# Altium project SRC Pneumatic Controller.PrjPcb
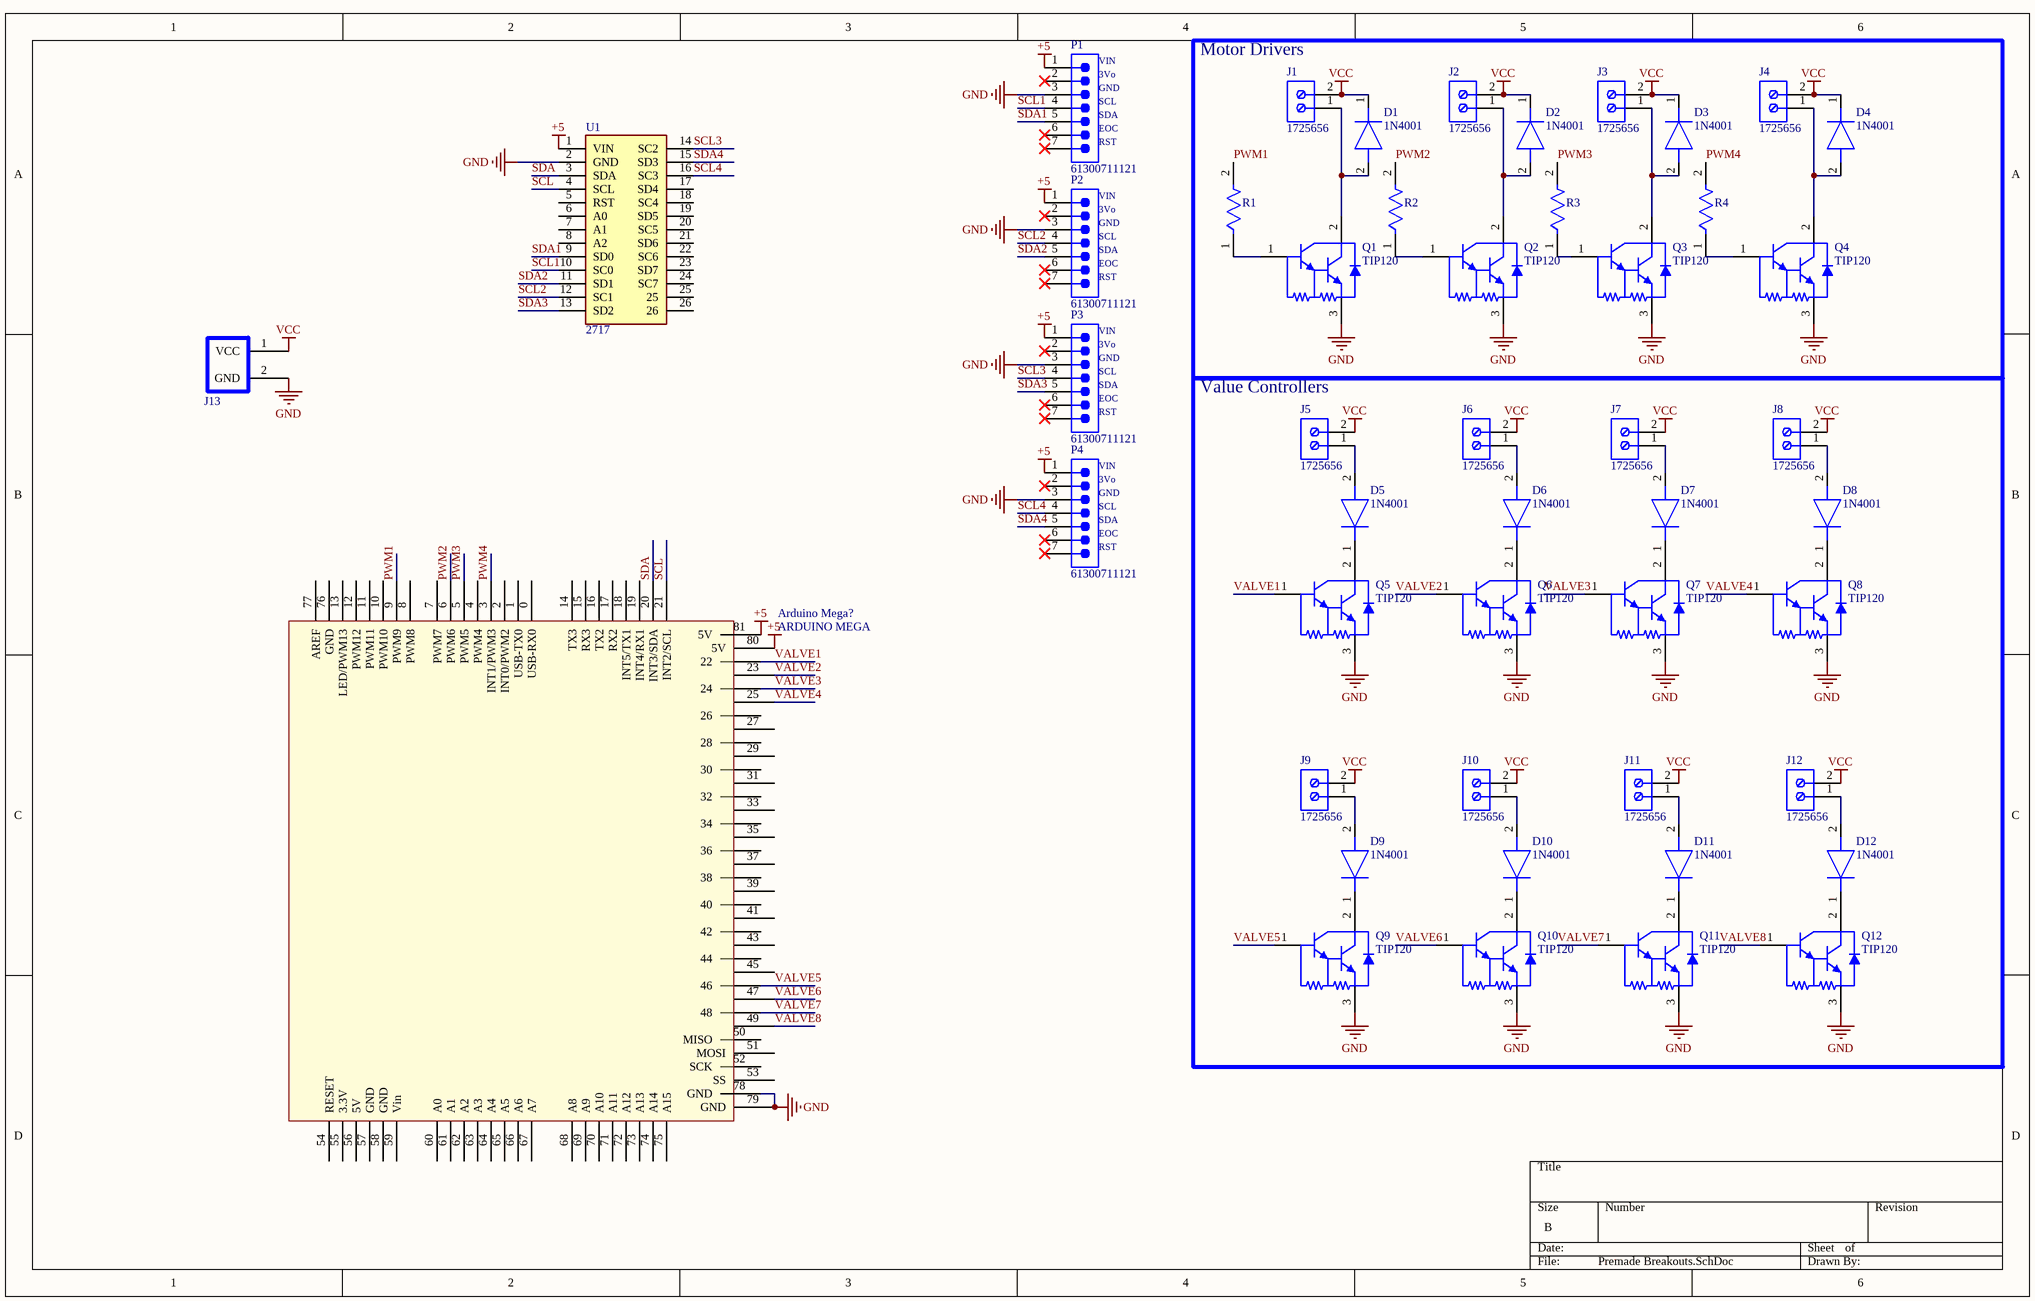
[diagram p0: Premade Breakouts.SchDoc]
1 sheet, 47 parts. Net scope: global (net labels, ports and power ports of the same name join across sheets).
Board file: MegaHatPnuematic.PcbDoc

## Sheet Premade Breakouts.SchDoc
size B; SheetNumber: 1; SheetTotal: 1

### Parts
Arduino_Mega?  ARDUINO MEGA  [Arduino Mega]
D1  1N4001  [DIOAD1530W84L490D260]
D2  1N4001  [DIOAD1530W84L490D260]
D3  1N4001  [DIOAD1530W84L490D260]
D4  1N4001  [DIOAD1530W84L490D260]
D5  1N4001  [DIOAD1530W84L490D260]
D6  1N4001  [DIOAD1530W84L490D260]
D7  1N4001  [DIOAD1530W84L490D260]
D8  1N4001  [DIOAD1530W84L490D260]
D9  1N4001  [DIOAD1530W84L490D260]
D10  1N4001  [DIOAD1530W84L490D260]
D11  1N4001  [DIOAD1530W84L490D260]
D12  1N4001  [DIOAD1530W84L490D260]
J1  1725656  [PHOE-1725656-2]
J2  1725656  [PHOE-1725656-2]
J3  1725656  [PHOE-1725656-2]
J4  1725656  [PHOE-1725656-2]
J5  1725656  [PHOE-1725656-2]
J6  1725656  [PHOE-1725656-2]
J7  1725656  [PHOE-1725656-2]
J8  1725656  [PHOE-1725656-2]
J9  1725656  [PHOE-1725656-2]
J10  1725656  [PHOE-1725656-2]
J11  1725656  [PHOE-1725656-2]
J12  1725656  [PHOE-1725656-2]
J13  Power  [PowerConnector]  (value not drawn)
P1  61300711121  [61300711121]
P2  61300711121  [61300711121]
P3  61300711121  [61300711121]
P4  61300711121  [61300711121]
Q1  TIP120  [ONSC-TO-220-3-221A-09]
Q2  TIP120  [ONSC-TO-220-3-221A-09]
Q3  TIP120  [ONSC-TO-220-3-221A-09]
Q4  TIP120  [ONSC-TO-220-3-221A-09]
Q5  TIP120  [ONSC-TO-220-3-221A-09]
Q6  TIP120  [ONSC-TO-220-3-221A-09]
Q7  TIP120  [ONSC-TO-220-3-221A-09]
Q8  TIP120  [ONSC-TO-220-3-221A-09]
Q9  TIP120  [ONSC-TO-220-3-221A-09]
Q10  TIP120  [ONSC-TO-220-3-221A-09]
Q11  TIP120  [ONSC-TO-220-3-221A-09]
Q12  TIP120  [ONSC-TO-220-3-221A-09]
R1  MRS25000C1000FRP00  [FP-MRS25-MFG]  (value not drawn)
R2  MRS25000C1000FRP00  [FP-MRS25-MFG]  (value not drawn)
R3  MRS25000C1000FRP00  [FP-MRS25-MFG]  (value not drawn)
R4  MRS25000C1000FRP00  [FP-MRS25-MFG]  (value not drawn)
U1  2717  [2717]

### Blocks framed on the sheet
Motor Drivers: D1-D4 J1-J4 Q1-Q4 R1-R4
Value Controllers: D5-D12 J5-J12 Q5-Q12

### Nets
+5: Arduino_Mega?.80(5V) Arduino_Mega?.81(5V) P1.1 P2.1 P3.1 P4.1 U1.1(VIN)
GND: Arduino_Mega?.78(GND) Arduino_Mega?.79(GND) J13.2(GND) P1.3 P2.3 P3.3 P4.3 Q1.3(E) Q2.3(E) Q3.3(E) Q4.3(E) Q5.3(E) Q6.3(E) Q7.3(E) Q8.3(E) Q9.3(E) Q10.3(E) Q11.3(E) Q12.3(E) U1.2(GND)
VCC: D1.1(K) D2.1(K) D3.1(K) D4.1(K) J1.2 J2.2 J3.2 J4.2 J5.2 J6.2 J7.2 J8.2 J9.2 J10.2 J11.2 J12.2 J13.1(VCC)
PWM1: Arduino_Mega?.9(PWM9) R1.2
PWM2: Arduino_Mega?.6(PWM6) R2.2
PWM3: Arduino_Mega?.5(PWM5) R3.2
PWM4: Arduino_Mega?.3(INT1/PWM3) R4.2
SCL: Arduino_Mega?.21(INT2/SCL) U1.4(SCL)
SCL1: P1.4 U1.10(SC0)
SCL2: P2.4 U1.12(SC1)
SCL3: P3.4 U1.14(SC2)
SCL4: P4.4 U1.16(SC3)
SDA: Arduino_Mega?.20(INT3/SDA) U1.3(SDA)
SDA1: P1.5 U1.9(SD0)
SDA2: P2.5 U1.11(SD1)
SDA3: P3.5 U1.13(SD2)
SDA4: P4.5 U1.15(SD3)
VALVE1: Arduino_Mega?.22 Q5.1(B)
VALVE2: Arduino_Mega?.23 Q6.1(B)
VALVE3: Arduino_Mega?.24 Q7.1(B)
VALVE4: Arduino_Mega?.25 Q8.1(B)
VALVE5: Arduino_Mega?.46 Q9.1(B)
VALVE6: Arduino_Mega?.47 Q10.1(B)
VALVE7: Arduino_Mega?.48 Q11.1(B)
VALVE8: Arduino_Mega?.49 Q12.1(B)
NetD1_2: D1.2(A) J1.1 Q1.2(C)
NetD2_2: D2.2(A) J2.1 Q2.2(C)
NetD3_2: D3.2(A) J3.1 Q3.2(C)
NetD4_2: D4.2(A) J4.1 Q4.2(C)
NetD5_1: D5.1(K) Q5.2(C)
NetD5_2: D5.2(A) J5.1
NetD6_1: D6.1(K) Q6.2(C)
NetD6_2: D6.2(A) J6.1
NetD7_1: D7.1(K) Q7.2(C)
NetD7_2: D7.2(A) J7.1
NetD8_1: D8.1(K) Q8.2(C)
NetD8_2: D8.2(A) J8.1
NetD9_1: D9.1(K) Q9.2(C)
NetD9_2: D9.2(A) J9.1
NetD10_1: D10.1(K) Q10.2(C)
NetD10_2: D10.2(A) J10.1
NetD11_1: D11.1(K) Q11.2(C)
NetD11_2: D11.2(A) J11.1
NetD12_1: D12.1(K) Q12.2(C)
NetD12_2: D12.2(A) J12.1
NetQ1_1: Q1.1(B) R1.1
NetQ2_1: Q2.1(B) R2.1
NetQ3_1: Q3.1(B) R3.1
NetQ4_1: Q4.1(B) R4.1

Not connected (* = marked no-connect by the designer): Arduino_Mega? 0(USB-RX0) 1(USB-TX0) 2(INT0/PWM2) 4(PWM4) 7(PWM7) 8(PWM8) 10(PWM10) 11(PWM11) 12(PWM12) 13(LED/PWM13) 14(TX3) 15(RX3) 16(TX2) 17(RX2) 18(INT5/TX1) 19(INT4/RX1) 26 27 28 29 30 31 32 33 34 35 36 37 38 39 40 41 42 43 44 45 50(MISO) 51(MOSI) 52(SCK) 53(SS) 54(RESET) 55(3.3V) 56(5V) 57(GND) 58(GND) 59(Vin) 60(A0) 61(A1) 62(A2) 63(A3) 64(A4) 65(A5) 66(A6) 67(A7) 68(A8) 69(A9) 70(A10) 71(A11) 72(A12) 73(A13) 74(A14) 75(A15) 76(GND) 77(AREF); P1 2* 6* 7*; P2 2* 6* 7*; P3 2* 6* 7*; P4 2* 6* 7*; U1 5(RST) 6(A0) 7(A1) 8(A2) 17(SD4) 18(SC4) 19(SD5) 20(SC5) 21(SD6) 22(SC6) 23(SD7) 24(SC7) 25 26

### Notes on the sheet
- (near P1) VIN
- (near P1) 3Vo
- (near P1) GND
- (near P1) SCL
- (near P1) SDA
- (near P1) EOC
- (near P1) RST
- (near P2) VIN
- (near P2) 3Vo
- (near P2) GND
- (near P2) SCL
- (near P2) SDA
- (near P2) EOC
- (near P2) RST
- (near P3) VIN
- (near P3) 3Vo
- (near P3) GND
- (near P3) SCL
- (near P3) SDA
- (near P3) EOC
- (near P3) RST
- (near P4) VIN
- (near P4) 3Vo
- (near P4) GND
- (near P4) SCL
- (near P4) SDA
- (near P4) EOC
- (near P4) RST

### Library data of the parts
D1-D12 = 1N4001: Diode; Manufacturer_Name: Diotec; Datasheet Link: https://www.arrow.com/en/products/1n4001/diotec-semiconductor-ag; Manufacturer_Part_Number: 1N4001; Mouser Part Number: 637-1N4001; Mouser Price/Stock: https://www.mouser.co.uk/ProductDetail/Diotec-Semiconductor/1N4001?qs=OlC7AqGiEDlll8NA510wmA%3D%3D; Arrow Part Number: 1N4001; Arrow Price/Stock: https://www.arrow.com/en/products/1n4001/diotec-semiconductor-ag?region=europe
J1-J12 = CMP-2000-05299-1: Male Header, Pitch 2.54 mm, 1 x 2 Position, Height 9 mm, Tail Length 3.5 mm; Manufacturer: Phoenix Contact; Number of contacts: 2; Content: 250pc(s); Pitch: 2.54mm; Industrial packaging: Yes; Colour: Green; Manufacturer part No.: 1725656; Type: MPT0,5/2-2,54; Datasheet URL: http://datasheet.octopart.com/1725656-Phoenix-Contact-datasheet-5302866.pdf; Manufacturer URL: http://www.phoenixcontact.com/; Datasheet Version: Apr-08
P1-P4 = CMP-1502-01074-3: NexarPartId: 32855531; Current Rating: 3A; Number of Positions: 7; Connector Type: Male Pin; Gender: Male; Operating Supply Voltage: 250V; Pitch: 2.54mm; Contact Resistance: 20mΩ; Contact Material: Copper; Contact Plating: Gold; Contact Mating Length: 5.9944mm; Mount: Through Hole; Termination: Solder; Number of Pins: 7; Color: Black; Packaging: Bulk; REACH SVHC: Unknown; Orientation: Vertical; Lead Pitch: 2.54mm; RoHS: Compliant; Number of Rows: 1; Number of Contacts: 7
Q1-Q12 = CMP-1047-00140-1: Plastic Medium-Power, Complementary Silicon Transistor, 3-Pin TO-220, Tube; Manufacturer: On Semiconductor; IC Continuous (A): 5; Polarity: NPN; ComponentLink2URL: http://www.onsemi.cn/pub_link/Collateral/TIP120-D.PDF; Packing: Tube; PartNumber: TIP120; ComponentLink3Description: Package Specification; PackageDescription: 3-Pin Flange Mount, Vertical Straight Lead, Body 9.97 x 4.445 mm, Pitch 2.54 mm; Mounting Technology: Through Hole; ComponentLink1URL: http://www.onsemi.com/; PackageVersion: Rev. AG, 09/2011; ComponentLink1Description: Manufacturer URL; PackageReference: TO-220-3-221A-09; ComponentLink2Description: Datasheet; RoHS: FALSE; DatasheetVersion: Rev. 8; ComponentLink3URL: http://www.onsemi.com/pub_link/Collateral/221A-09.PDF
R1-R4 = CMP-00030-42757237-1: MRS25000C1000FRP00 Resistor, 100 Ohm, ± 1%, 600 mW, Axial Leaded, Metal Film (Thin Film), Professional; Max Power Dissipation: 600mW; Resistance: 100Ω; Voltage Rating: 350V; Temperature Coefficient: 50ppm/°C; Lead Diameter: 600µm; RoHS: Compliant; Radiation Hardening: No; Schedule B: 8533210090, 8533210090; Length: 6.5mm; Packaging: Tape & Reel (TR); Number of Terminations: 2; Mount: Through Hole; Width: 2.5mm; Tolerance: 1%; Military Standard: Not; Voltage Rating (DC): 350V; Contact Plating: Tin; Number of Pins: 2; Max Operating Temperature: 155°C; NexarPartId: 42757237; Diameter: 2.5mm; Composition: Metal Film, Thin Film; REACH SVHC: Unknown; Power Rating: 600mW; Lead Free: Lead Free; Termination: Axial; Case/Package: Axial; Min Operating Temperature: -55°C
U1 = 2717: Undefined or Miscellaneous; Manufacturer_Name: Adafruit; Datasheet Link: https://learn.adafruit.com/downloads/pdf/adafruit-tca9548a-1-to-8-i2c-multiplexer-breakout.pdf; Height: 1mm; Manufacturer_Part_Number: 2717; Mouser Part Number: 485-2717; Mouser Price/Stock: https://www.mouser.co.uk/ProductDetail/Adafruit/2717?qs=FXKxjuMTmBk%252BXQsxVhda7A%3D%3D; Arrow Part Number: 2717; Arrow Price/Stock: https://www.arrow.com/en/products/2717/adafruit-industries?region=nac